# Altium project Kenworth_Overview_2.PrjPcb (part 2 of 4)

## Sheet T-Type_System.SchDoc: <Document>
size Letter; Engineer: <Engineer>; Organization: UPEL; Address1: USU Power Electronics Lab; Address2: USTAR Building 620, RM 118; Address3: 1600 N 620 E; Address4: North Logan, UT 84341; DocumentNumber: 8; Revision: v1; SheetNumber: 8; SheetTotal: 16; ProjectName: <Project>
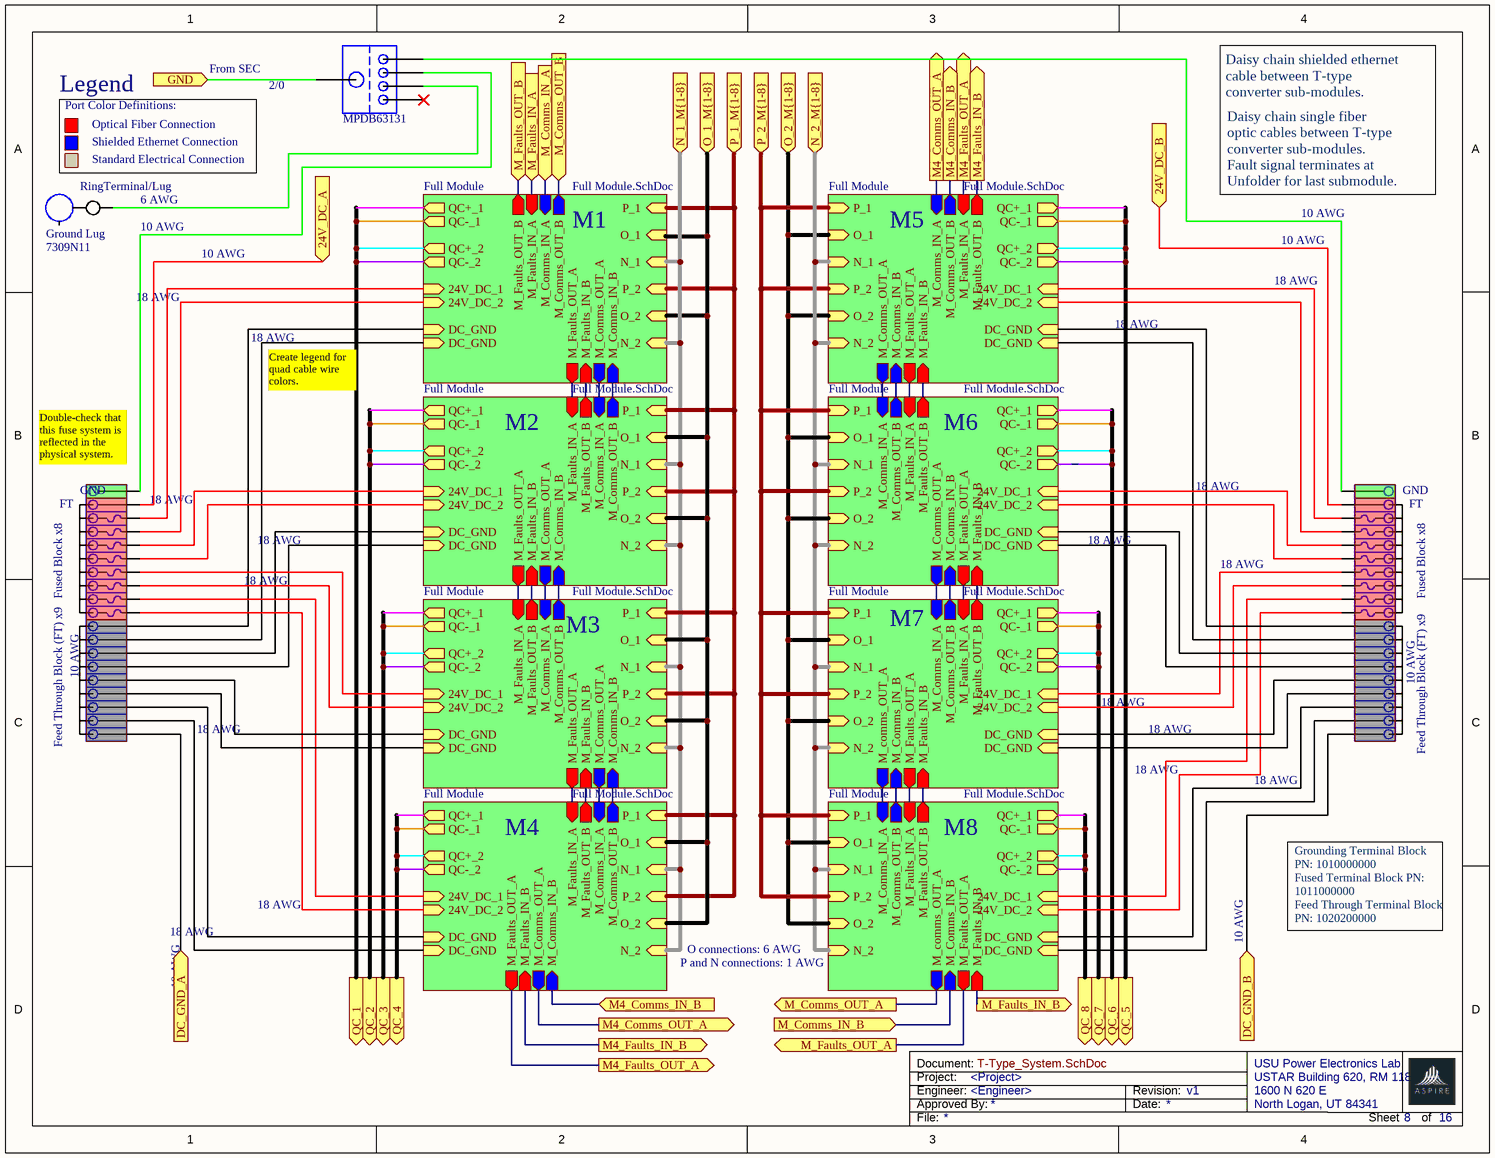
[diagram p5: T-Type_System.SchDoc]

### Parts
(Parts that share a designator on the sheet are numbered #1, #2 ... from top to bottom, then left to right.)
7309N11#1  Ground Lug
*#1  RingTerminal/Lug
J?#1  MPDB63131
J?#2  8_pos_terminal  (value not drawn)
J?#3  8_pos_terminal  (value not drawn)

### Sub-sheets
Full Module = Full Module.SchDoc (file not in this document): M_Faults_IN_B (in), M_Comms_OUT_A (out), M_Faults_IN_A (in), M_Comms_IN_A (in), P_1 (in), O_1 (in), N_1 (in), QC+_1 (out), QC-_1 (out), P_2 (in), O_2 (in), N_2 (in), QC+_2 (out), QC-_2 (out), DC_GND (in), 24V_DC_2 (in), 24V_DC_1 (in), DC_GND (in), M_Comms_OUT_B (out), M_Comms_IN_B (in), M_Faults_OUT_A (out), M_Faults_OUT_B (out)
Full Module = Full Module.SchDoc (file not in this document): M_Faults_IN_B (in), M_Comms_OUT_A (out), M_Faults_OUT_B (out), M_Comms_IN_A (in), P_1 (in), O_1 (in), N_1 (in), QC+_1 (out), QC-_1 (out), P_2 (in), O_2 (in), N_2 (in), QC+_2 (out), QC-_2 (out), DC_GND (in), DC_GND (in), 24V_DC_1 (in), 24V_DC_2 (in), M_Comms_OUT_B (out), M_Comms_IN_B (in), M_Faults_IN_A (in), M_Faults_OUT_A (out)
Full Module = Full Module.SchDoc (file not in this document): M_Faults_IN_B (in), M_comms_OUT_A (out), M_Faults_OUT_B (out), M_Comms_IN_A (in), P_1 (in), O_1 (in), N_1 (in), QC+_1 (out), QC-_1 (out), P_2 (in), O_2 (in), N_2 (in), QC+_2 (out), QC-_2 (out), DC_GND (in), DC_GND (in), 24V_DC_2 (in), 24V_DC_1 (in), M_Comms_OUT_B (out), M_Comms_IN_B (in), M_Faults_OUT_A (out), M_Faults_IN_A (in)
Full Module = Full Module.SchDoc (file not in this document): M_Faults_OUT_A (out), M_comms_OUT_A (out), M_Faults_OUT_B (out), M_Comms_IN_A (in), P_1 (in), O_1 (in), N_1 (in), QC+_1 (out), QC-_1 (out), P_2 (in), O_2 (in), N_2 (in), QC+_2 (out), QC-_2 (out), DC_GND (in), DC_GND (in), 24V_DC_2 (in), 24V_DC_1 (in), M_Comms_OUT_B (out), M_Comms_IN_B (in), M_Faults_IN_A (in), M_Faults_IN_B (in)
Full Module = Full Module.SchDoc (file not in this document): M_Faults_OUT_A (out), M_Comms_OUT_A (out), M_Faults_IN_A (in), M_Comms_IN_A (in), P_1 (in), O_1 (in), N_1 (in), QC+_1 (out), QC-_1 (out), P_2 (in), O_2 (in), N_2 (in), QC+_2 (out), QC-_2 (out), DC_GND (in), 24V_DC_2 (in), 24V_DC_1 (in), DC_GND (in), M_Comms_OUT_B (out), M_Comms_IN_B (in), M_Faults_OUT_B (out), M_Faults_IN_B (in)
Full Module = Full Module.SchDoc (file not in this document): M_Faults_OUT_A (out), M_Comms_OUT_A (out), M_Faults_IN_A (in), M_Comms_IN_A (in), P_1 (in), O_1 (in), N_1 (in), QC+_1 (out), QC-_1 (out), P_2 (in), O_2 (in), N_2 (in), QC+_2 (out), QC-_2 (out), DC_GND (in), DC_GND (in), 24V_DC_1 (in), 24V_DC_2 (in), M_Comms_OUT_B (out), M_Comms_IN_B (in), M_Faults_OUT_B (out), M_Faults_IN_B (in)
Full Module = Full Module.SchDoc (file not in this document): M_Faults_OUT_A (out), M_Comms_OUT_A (out), M_Faults_IN_A (in), M_Comms_IN_A (in), P_1 (in), O_1 (in), N_1 (in), QC+_1 (out), QC-_1 (out), P_2 (in), O_2 (in), N_2 (in), QC+_2 (out), QC-_2 (out), DC_GND (in), DC_GND (in), 24V_DC_2 (in), 24V_DC_1 (in), M_Comms_OUT_B (out), M_Comms_IN_B (in), M_Faults_OUT_B (out), M_Faults_IN_B (in)
Full Module = Full Module.SchDoc (file not in this document): M_Faults_OUT_A (out), M_Comms_OUT_A (out), M_Faults_IN_A (in), M_Comms_IN_A (in), P_1 (in), O_1 (in), N_1 (in), QC+_1 (out), QC-_1 (out), P_2 (in), O_2 (in), N_2 (in), QC+_2 (out), QC-_2 (out), DC_GND (in), DC_GND (in), 24V_DC_2 (in), 24V_DC_1 (in), M_Comms_OUT_B (out), M_Comms_IN_B (in), M_Faults_IN_B (in), M_Faults_OUT_B (out)

### Ports
24V_DC_A (in), 24V_DC_B (in), DC_GND_A (in), DC_GND_B (in), GND (in), M4_Comms_IN_B (in), M4_Comms_IN_B (out), M4_Comms_OUT_A (out), M4_Faults_IN_B (out), M4_Faults_OUT_A (out), M_Comms_IN_A (in), M_Comms_IN_B (in), M_Comms_OUT_A (out), M_Comms_OUT_B (in), M_Faults_IN_A (in), M_Faults_IN_B (out), M_Faults_OUT_A (out), M_Faults_OUT_B (in), N_1_M{1-8} (in), N_2_M{1-8} (in), O_1_M{1-8} (in), O_2_M{1-8} (in), P_1_M{1-8} (in), P_2_M{1-8} (in), QC_1 (out), QC_2 (out), QC_3 (out), QC_4 (out), QC_5 (out), QC_6 (out), QC_7 (out), QC_8 (out)

### Nets
24V_DC_A: J?#2.3 ; port 24V_DC_A
24V_DC_B: J?#3.3 ; port 24V_DC_B
DC_GND_A: J?#2.1 ; port DC_GND_A
DC_GND_B: J?#3.1 ; port DC_GND_B
GND: J?#1.0 ; port GND
M4_Comms_IN_B: port M4_Comms_IN_B, sheet Full Module/M_Comms_OUT_B, sheet Full Module/M_Comms_IN_B
M4_Comms_OUT_A: port M4_Comms_OUT_A, sheet Full Module/M_Comms_IN_A, sheet Full Module/M_Comms_OUT_A
M4_Faults_IN_B: port M4_Faults_IN_B, sheet Full Module/M_Faults_OUT_B, sheet Full Module/M_Faults_IN_B
M4_Faults_OUT_A: port M4_Faults_OUT_A, sheet Full Module/M_Faults_IN_A, sheet Full Module/M_Faults_OUT_A
M_Comms_IN_A: port M_Comms_IN_A, sheet Full Module/M_Comms_IN_A
M_Comms_IN_B: port M_Comms_IN_B, sheet Full Module/M_Comms_IN_B
M_Comms_OUT_A: port M_Comms_OUT_A, sheet Full Module/M_comms_OUT_A
M_Comms_OUT_B: port M_Comms_OUT_B, sheet Full Module/M_Comms_OUT_B
M_Faults_IN_A: port M_Faults_IN_A, sheet Full Module/M_Faults_IN_A
M_Faults_IN_B: port M_Faults_IN_B, sheet Full Module/M_Faults_IN_B
M_Faults_OUT_A: port M_Faults_OUT_A, sheet Full Module/M_Faults_OUT_A
M_Faults_OUT_B: port M_Faults_OUT_B, sheet Full Module/M_Faults_OUT_B
N_1_M{1-8}: port N_1_M{1-8}, sheet Full Module/N_1, sheet Full Module/N_2, sheet Full Module/N_1, sheet Full Module/N_2, sheet Full Module/N_1, sheet Full Module/N_2, sheet Full Module/N_1, sheet Full Module/N_2
N_2_M{1-8}: port N_2_M{1-8}, sheet Full Module/N_1, sheet Full Module/N_2, sheet Full Module/N_1, sheet Full Module/N_2, sheet Full Module/N_1, sheet Full Module/N_2, sheet Full Module/N_1, sheet Full Module/N_2
O_1_M{1-8}: port O_1_M{1-8}, sheet Full Module/O_2, sheet Full Module/O_1, sheet Full Module/O_2, sheet Full Module/O_1, sheet Full Module/O_2, sheet Full Module/O_1, sheet Full Module/O_2
O_2_M{1-8}: port O_2_M{1-8}, sheet Full Module/O_1, sheet Full Module/O_2, sheet Full Module/O_1, sheet Full Module/O_2, sheet Full Module/O_1, sheet Full Module/O_2, sheet Full Module/O_1, sheet Full Module/O_2
P_1_M{1-8}: port P_1_M{1-8}, sheet Full Module/P_1, sheet Full Module/P_2, sheet Full Module/P_1, sheet Full Module/P_2, sheet Full Module/P_1, sheet Full Module/P_2, sheet Full Module/P_1, sheet Full Module/P_2
P_2_M{1-8}: port P_2_M{1-8}, sheet Full Module/P_1, sheet Full Module/P_2, sheet Full Module/P_1, sheet Full Module/P_2, sheet Full Module/P_1, sheet Full Module/P_2, sheet Full Module/P_1, sheet Full Module/P_2
QC_1: port QC_1, sheet Full Module/QC+_1, sheet Full Module/QC-_1, sheet Full Module/QC+_2, sheet Full Module/QC-_2
QC_2: port QC_2, sheet Full Module/QC+_1, sheet Full Module/QC-_1, sheet Full Module/QC+_2, sheet Full Module/QC-_2
QC_3: port QC_3, sheet Full Module/QC+_1, sheet Full Module/QC-_1, sheet Full Module/QC+_2, sheet Full Module/QC-_2
QC_4: port QC_4, sheet Full Module/QC+_1, sheet Full Module/QC-_1, sheet Full Module/QC+_2, sheet Full Module/QC-_2
QC_5: port QC_5, sheet Full Module/QC+_1, sheet Full Module/QC-_1, sheet Full Module/QC+_2, sheet Full Module/QC-_2
QC_6: port QC_6, sheet Full Module/QC+_1, sheet Full Module/QC-_1, sheet Full Module/QC+_2, sheet Full Module/QC-_2
QC_7: port QC_7, sheet Full Module/QC+_1, sheet Full Module/QC-_1, sheet Full Module/QC+_2, sheet Full Module/QC-_2
QC_8: port QC_8, sheet Full Module/QC+_1, sheet Full Module/QC-_1, sheet Full Module/QC+_2, sheet Full Module/QC-_2
Net7309N11#1_5: 7309N11#1.5 *#1.2_13
Net*#1_2_12: *#1.2_12 J?#1.2
NetJ?#1_4: J?#1.4 J?#2.1
NetJ?#1_5: J?#1.5 J?#3.1
NetJ?#2_1: J?#2.1 ; sheet Full Module/DC_GND
NetJ?#2_1: J?#2.1 ; sheet Full Module/DC_GND  [a separate net that carries the same name]
NetJ?#2_1: J?#2.1 ; sheet Full Module/DC_GND  [a separate net that carries the same name]
NetJ?#2_1: J?#2.1 ; sheet Full Module/DC_GND  [a separate net that carries the same name]
NetJ?#2_1: J?#2.1 ; sheet Full Module/DC_GND  [a separate net that carries the same name]
NetJ?#2_1: J?#2.1 ; sheet Full Module/DC_GND  [a separate net that carries the same name]
NetJ?#2_1: J?#2.1 ; sheet Full Module/DC_GND  [a separate net that carries the same name]
NetJ?#2_1: J?#2.1 ; sheet Full Module/DC_GND  [a separate net that carries the same name]
NetJ?#2_3: J?#2.3 ; sheet Full Module/24V_DC_1
NetJ?#2_3: J?#2.3 ; sheet Full Module/24V_DC_2  [a separate net that carries the same name]
NetJ?#2_3: J?#2.3 ; sheet Full Module/24V_DC_2  [a separate net that carries the same name]
NetJ?#2_3: J?#2.3 ; sheet Full Module/24V_DC_1  [a separate net that carries the same name]
NetJ?#2_3: J?#2.3 ; sheet Full Module/24V_DC_2  [a separate net that carries the same name]
NetJ?#2_3: J?#2.3 ; sheet Full Module/24V_DC_1  [a separate net that carries the same name]
NetJ?#2_3: J?#2.3 ; sheet Full Module/24V_DC_2  [a separate net that carries the same name]
NetJ?#2_3: J?#2.3 ; sheet Full Module/24V_DC_1  [a separate net that carries the same name]
NetJ?#3_1: J?#3.1 ; sheet Full Module/DC_GND
NetJ?#3_1: J?#3.1 ; sheet Full Module/DC_GND  [a separate net that carries the same name]
NetJ?#3_1: J?#3.1 ; sheet Full Module/DC_GND  [a separate net that carries the same name]
NetJ?#3_1: J?#3.1 ; sheet Full Module/DC_GND  [a separate net that carries the same name]
NetJ?#3_1: J?#3.1 ; sheet Full Module/DC_GND  [a separate net that carries the same name]
NetJ?#3_1: J?#3.1 ; sheet Full Module/DC_GND  [a separate net that carries the same name]
NetJ?#3_1: J?#3.1 ; sheet Full Module/DC_GND  [a separate net that carries the same name]
NetJ?#3_1: J?#3.1 ; sheet Full Module/DC_GND  [a separate net that carries the same name]
NetJ?#3_3: J?#3.3 ; sheet Full Module/24V_DC_1
NetJ?#3_3: J?#3.3 ; sheet Full Module/24V_DC_2  [a separate net that carries the same name]
NetJ?#3_3: J?#3.3 ; sheet Full Module/24V_DC_2  [a separate net that carries the same name]
NetJ?#3_3: J?#3.3 ; sheet Full Module/24V_DC_1  [a separate net that carries the same name]
NetJ?#3_3: J?#3.3 ; sheet Full Module/24V_DC_2  [a separate net that carries the same name]
NetJ?#3_3: J?#3.3 ; sheet Full Module/24V_DC_1  [a separate net that carries the same name]
NetJ?#3_3: J?#3.3 ; sheet Full Module/24V_DC_2  [a separate net that carries the same name]
NetJ?#3_3: J?#3.3 ; sheet Full Module/24V_DC_1  [a separate net that carries the same name]
(unnamed): sheet Full Module/M_Faults_IN_B, sheet Full Module/M_Faults_OUT_B
(unnamed): sheet Full Module/M_Comms_OUT_A, sheet Full Module/M_Comms_IN_A
(unnamed): sheet Full Module/M_Comms_IN_B, sheet Full Module/M_Comms_OUT_B
(unnamed): sheet Full Module/M_Faults_OUT_A, sheet Full Module/M_Faults_IN_A
(unnamed): sheet Full Module/M_Faults_IN_B, sheet Full Module/M_Faults_OUT_B
(unnamed): sheet Full Module/M_Comms_OUT_A, sheet Full Module/M_Comms_IN_A
(unnamed): sheet Full Module/M_Comms_IN_B, sheet Full Module/M_Comms_OUT_B
(unnamed): sheet Full Module/M_Faults_OUT_A, sheet Full Module/M_Faults_IN_A
(unnamed): sheet Full Module/M_Faults_IN_B, sheet Full Module/M_Faults_OUT_B
(unnamed): sheet Full Module/M_comms_OUT_A, sheet Full Module/M_Comms_IN_A
(unnamed): sheet Full Module/M_Comms_IN_B, sheet Full Module/M_Comms_OUT_B
(unnamed): sheet Full Module/M_Faults_OUT_A, sheet Full Module/M_Faults_IN_A
(unnamed): sheet Full Module/M_Faults_OUT_A, sheet Full Module/M_Faults_IN_A
(unnamed): sheet Full Module/M_Comms_OUT_A, sheet Full Module/M_Comms_IN_A
(unnamed): sheet Full Module/M_Comms_IN_B, sheet Full Module/M_Comms_OUT_B
(unnamed): sheet Full Module/M_Faults_IN_B, sheet Full Module/M_Faults_OUT_B
(unnamed): sheet Full Module/M_Faults_OUT_A, sheet Full Module/M_Faults_IN_A
(unnamed): sheet Full Module/M_Comms_OUT_A, sheet Full Module/M_Comms_IN_A
(unnamed): sheet Full Module/M_Comms_IN_B, sheet Full Module/M_Comms_OUT_B
(unnamed): sheet Full Module/M_Faults_IN_B, sheet Full Module/M_Faults_OUT_B
(unnamed): sheet Full Module/M_Faults_OUT_A, sheet Full Module/M_Faults_IN_A
(unnamed): sheet Full Module/M_Comms_OUT_A, sheet Full Module/M_Comms_IN_A
(unnamed): sheet Full Module/M_Comms_IN_B, sheet Full Module/M_Comms_OUT_B
(unnamed): sheet Full Module/M_Faults_IN_B, sheet Full Module/M_Faults_OUT_B

Not connected (* = marked no-connect by the designer): J?#1 1*

### Notes on the sheet
- Legend
- From SEC
- 2/0
- Port Color Definitions:
- Optical Fiber Connection
- Shielded Ethernet Connection
- Standard Electrical Connection
- Daisy chain shielded ethernet
  cable between T-type
  converter sub-modules.
- 10 AWG
- 6 AWG
- M1
- M5
- Daisy chain single fiber
  optic cables between T-type
  converter sub-modules.
  Fault signal terminates at
  Unfolder for last submodule.
- 18 AWG
- Create legend for quad cable wire colors.
- M2
- M6
- (near J?#2) Double-check that this fuse system is reflected in the physical system.
- (near J?#2) FT
- (near J?#2) GND
- (near J?#3) GND
- (near J?#3) FT
- (near J?#2) Fused Block x8
- (near J?#2) 10 AWG
- M3
- M7
- (near J?#3) 10 AWG
- (near J?#3) Fused Block x8
- (near J?#2) Feed Through Block (FT) x9
- (near J?#3) Feed Through Block (FT) x9
- M4
- M8
- Grounding Terminal Block PN: 1010000000
- Fused Terminal Block PN: 1011000000
- P and N connections: 1 AWG
- O connections: 6 AWG
- Feed Through Terminal Block PN: 1020200000
- Project:
- Engineer:
- Document:
- Approved By:
- Date:
- Revision:
- File:
- Sheet
- of

### Library data of the parts
7309N11#1 = 7309N11
J?#1 = 4_to_1
J?#2 J?#3 = Full_Terminal_Block

## Sheet Coolant_System.SchDoc: <Document>
size Letter; Engineer: <Engineer>; Organization: UPEL; Address1: USU Power Electronics Lab; Address2: USTAR Building 620, RM 118; Address3: 1600 N 620 E; Address4: North Logan, UT 84341; DocumentNumber: 15; Revision: v1; SheetNumber: 15; SheetTotal: 16; ProjectName: <Project>
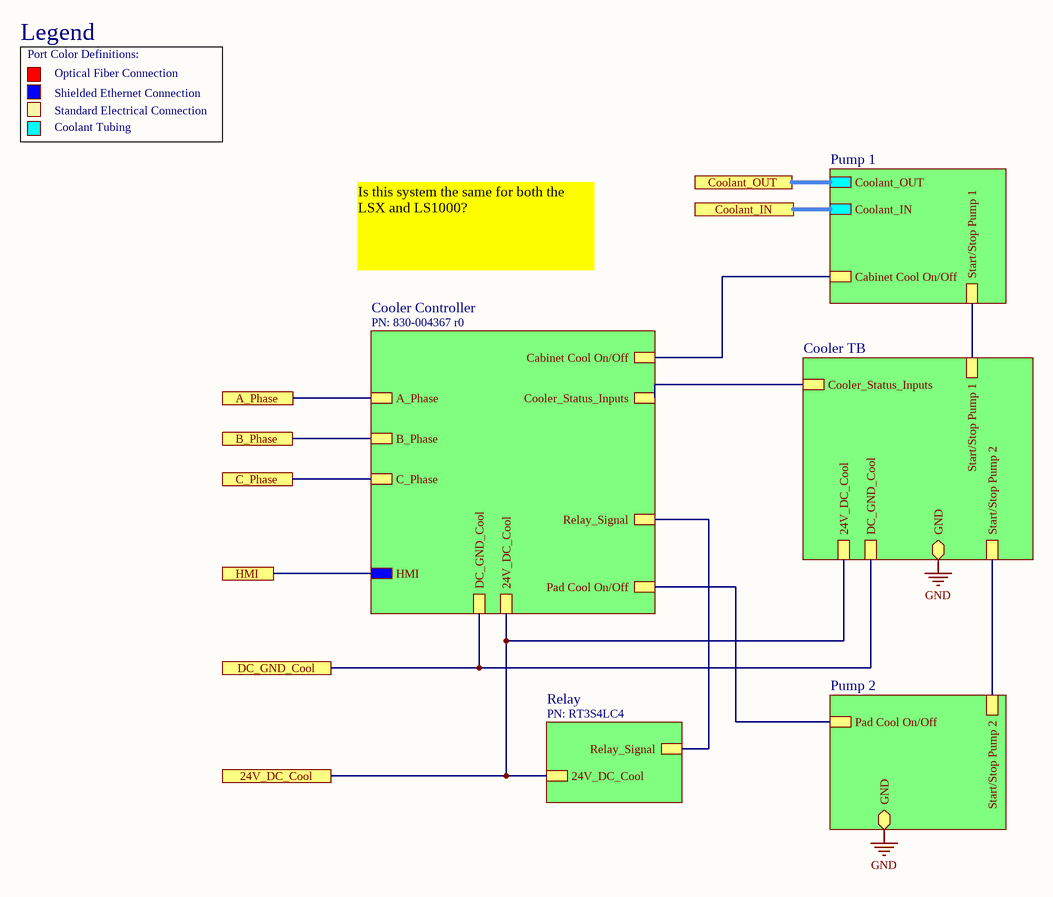
[diagram p6: Coolant_System.SchDoc]

### Sub-sheets
Designator = Cooler Controller (file not in this document): DC_GND_Cool, 24V_DC_Cool, HMI, A_Phase, B_Phase, C_Phase, Relay_Signal, Cooler_Status_Inputs, Pad Cool On/Off, Cabinet Cool On/Off
Designator = Pump 1 (file not in this document): Cabinet Cool On/Off, Coolant_OUT, Coolant_IN, Start/Stop Pump 1
Designator = Pump 2 (file not in this document): Pad Cool On/Off, Start/Stop Pump 2, GND (bidir)
Designator = Cooler TB (file not in this document): Cooler_Status_Inputs, 24V_DC_Cool, DC_GND_Cool, GND (bidir), Start/Stop Pump 1, Start/Stop Pump 2
Relay = Relay (file not in this document): 24V_DC_Cool, Relay_Signal

### Ports
24V_DC_Cool, A_Phase, B_Phase, C_Phase, Coolant_IN, Coolant_OUT, DC_GND_Cool, HMI

### Nets
GND: sheet Designator/GND, sheet Designator/GND
24V_DC_Cool: port 24V_DC_Cool, sheet Relay/24V_DC_Cool, sheet Designator/24V_DC_Cool, sheet Designator/24V_DC_Cool
A_Phase: port A_Phase, sheet Designator/A_Phase
B_Phase: port B_Phase, sheet Designator/B_Phase
C_Phase: port C_Phase, sheet Designator/C_Phase
Coolant_IN: port Coolant_IN, sheet Designator/Coolant_IN
Coolant_OUT: port Coolant_OUT, sheet Designator/Coolant_OUT
DC_GND_Cool: port DC_GND_Cool, sheet Designator/DC_GND_Cool, sheet Designator/DC_GND_Cool
HMI: port HMI, sheet Designator/HMI
(unnamed): sheet Relay/Relay_Signal, sheet Designator/Relay_Signal
(unnamed): sheet Designator/Cooler_Status_Inputs, sheet Designator/Cooler_Status_Inputs
(unnamed): sheet Designator/Pad Cool On/Off, sheet Designator/Pad Cool On/Off
(unnamed): sheet Designator/Cabinet Cool On/Off, sheet Designator/Cabinet Cool On/Off
(unnamed): sheet Designator/Start/Stop Pump 1, sheet Designator/Start/Stop Pump 1
(unnamed): sheet Designator/Start/Stop Pump 2, sheet Designator/Start/Stop Pump 2

### Notes on the sheet
- Legend
- Port Color Definitions:
- Optical Fiber Connection
- Shielded Ethernet Connection
- Standard Electrical Connection
- Coolant Tubing
- Is this system the same for both the LSX and LS1000?
- PN: 830-004367 r0
- PN: RT3S4LC4
- Project:
- Engineer:
- Document:
- Approved By:
- Date:
- Revision:
- File:
- Sheet
- of

## Sheet Current_and_Water_Sensing_System.SchDoc
size A
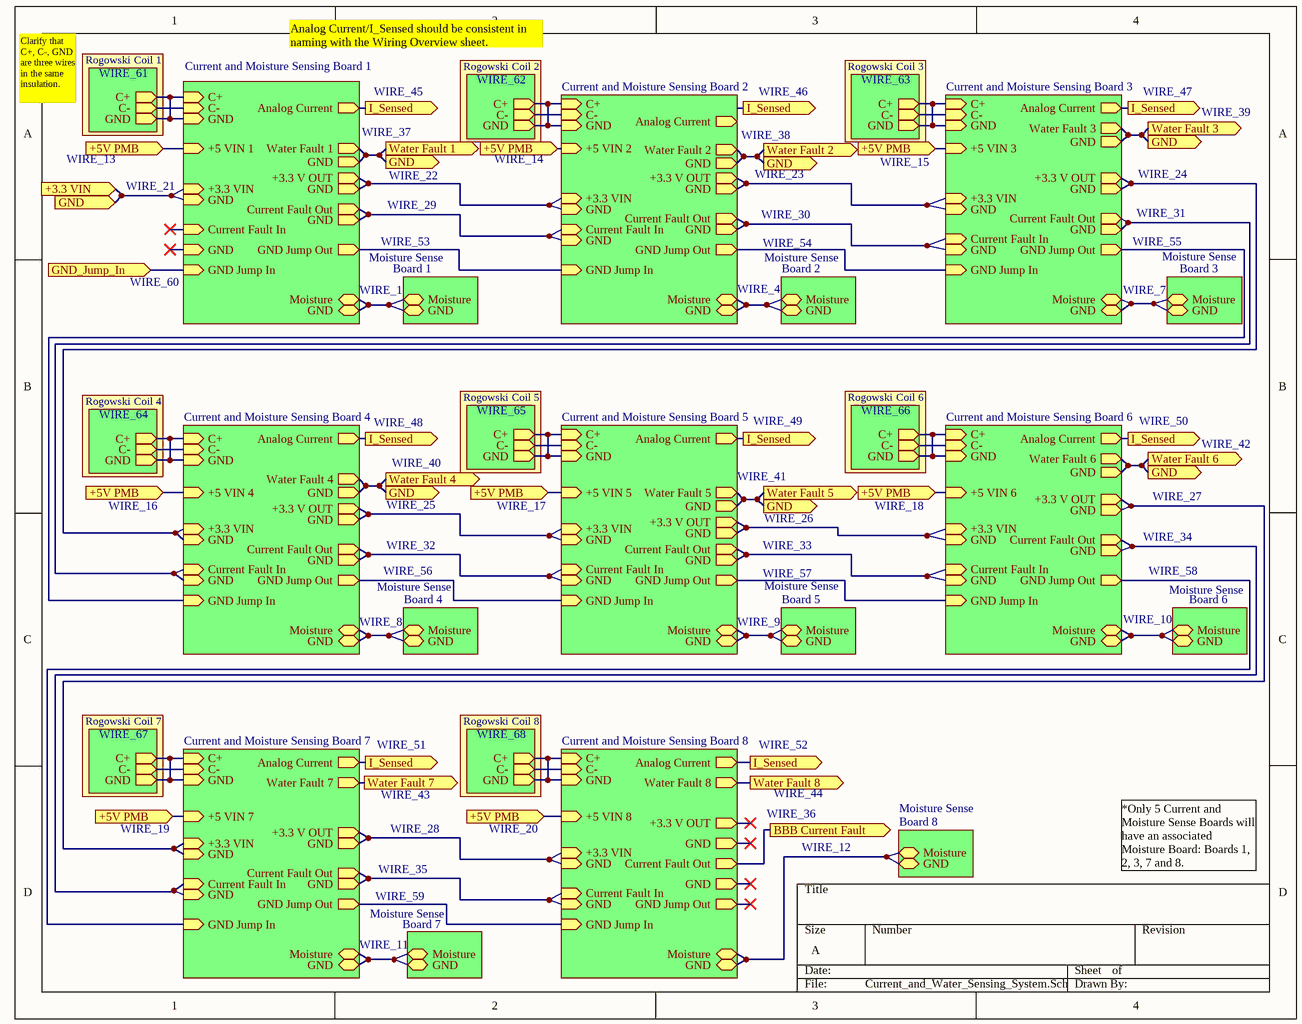
[diagram p7: Current_and_Water_Sensing_System.SchDoc]

### Sub-sheets
Board 1 = File Name (file not in this document): GND (bidir), Moisture (bidir)
Board 2 = File Name (file not in this document): GND (bidir), Moisture (bidir)
Board 3 = File Name (file not in this document): GND (bidir), Moisture (bidir)
Board 4 = File Name (file not in this document): GND (bidir), Moisture (bidir)
Board 5 = File Name (file not in this document): GND (bidir), Moisture (bidir)
Board 6 = File Name (file not in this document): GND (bidir), Moisture (bidir)
Board 7 = File Name (file not in this document): GND (bidir), Moisture (bidir)
Board 8 = File Name (file not in this document): GND (bidir), Moisture (bidir)
Coil 1 = File Name (file not in this document): GND (out), C- (out), C+ (out)
Coil 2 = File Name (file not in this document): GND (out), C- (out), C+ (out)
Coil 3 = File Name (file not in this document): GND (out), C- (out), C+ (out)
Coil 4 = File Name (file not in this document): GND (out), C- (out), C+ (out)
Coil 5 = File Name (file not in this document): GND (out), C- (out), C+ (out)
Coil 6 = File Name (file not in this document): GND (out), C- (out), C+ (out)
Coil 7 = File Name (file not in this document): GND (out), C- (out), C+ (out)
Coil 8 = File Name (file not in this document): GND (out), C- (out), C+ (out)
Current and Moisture Sensing Board 1 = File Name (file not in this document): C- (in), GND (in), Analog Current (out), Water Fault 1 (out), GND (bidir), +3.3 V OUT (out), GND Jump Out (out), +5 VIN 1 (in), +3.3 VIN (in), Current Fault Out (out), Moisture (bidir), Current Fault In (in), GND (in), GND (in), GND (out), GND (out), GND Jump In (in), GND (out), C+ (in)
Current and Moisture Sensing Board 2 = File Name (file not in this document): Analog Current (out), Water Fault 2 (out), GND (bidir), +3.3 V OUT (out), GND Jump Out (out), +5 VIN 2 (in), +3.3 VIN (in), Current Fault Out (out), Moisture (bidir), Current Fault In (in), GND (in), GND (in), GND (out), GND (out), GND Jump In (in), GND (out), C- (in), GND (in), C+ (in)
Current and Moisture Sensing Board 3 = File Name (file not in this document): Analog Current (out), Water Fault 3 (out), GND (bidir), +3.3 V OUT (out), GND Jump Out (out), +5 VIN 3 (in), +3.3 VIN (in), Current Fault Out (out), Moisture (bidir), Current Fault In (in), GND (in), GND (in), GND (out), GND (out), GND Jump In (in), GND (out), C- (in), GND (in), C+ (in)
Current and Moisture Sensing Board 4 = File Name (file not in this document): Analog Current (out), Water Fault 4 (out), GND (bidir), +3.3 V OUT (out), GND Jump Out (out), +5 VIN 4 (in), +3.3 VIN (in), Current Fault Out (out), Moisture (bidir), Current Fault In (in), GND (in), GND (in), GND (out), GND (out), GND Jump In (in), GND (out), C- (in), GND (in), C+ (in)
Current and Moisture Sensing Board 5 = File Name (file not in this document): Analog Current (out), Water Fault 5 (out), GND (bidir), +3.3 V OUT (out), GND Jump Out (out), +5 VIN 5 (in), +3.3 VIN (in), Current Fault Out (out), Moisture (bidir), Current Fault In (in), GND (in), GND (in), GND (out), GND (out), GND Jump In (in), GND (out), C- (in), GND (in), C+ (in)
Current and Moisture Sensing Board 6 = File Name (file not in this document): Analog Current (out), Water Fault 6 (out), GND (bidir), +3.3 V OUT (out), GND Jump Out (out), +5 VIN 6 (in), +3.3 VIN (in), Current Fault Out (out), Moisture (bidir), Current Fault In (in), GND (in), GND (in), GND (out), GND (out), GND Jump In (in), GND (out), C- (in), GND (in), C+ (in)
Current and Moisture Sensing Board 7 = File Name (file not in this document): Analog Current (out), Water Fault 7 (out), +3.3 V OUT (out), GND Jump Out (out), +5 VIN 7 (in), +3.3 VIN (in), Current Fault Out (out), Current Fault In (in), GND (in), GND (in), GND (out), GND (out), GND Jump In (in), Moisture (bidir), GND (bidir), C- (in), GND (in), C+ (in)
Current and Moisture Sensing Board 8 = File Name (file not in this document): Analog Current (out), Water Fault 8 (out), +3.3 V OUT (out), GND Jump Out (out), +5 VIN 8 (in), +3.3 VIN (in), Current Fault Out (out), Current Fault In (in), GND (in), GND (in), GND (out), GND (out), GND Jump In (in), Moisture (bidir), GND (bidir), C- (in), GND (in), C+ (in)

### Ports
+3.3 VIN (in), +5V PMB (in), BBB Current Fault (out), GND (in), GND (out), GND_Jump_In (in), I_Sensed (out), Water Fault 1 (out), Water Fault 2 (out), Water Fault 3 (out), Water Fault 4 (out), Water Fault 5 (out), Water Fault 6 (out), Water Fault 7 (out), Water Fault 8 (out)

### Nets
+3.3 VIN: port Water Fault 1, port Water Fault 4, port Water Fault 2, port Water Fault 5, port Water Fault 3, port Water Fault 6, port +3.3 VIN, port GND, sheet Current and Moisture Sensing Board 2/Water Fault 2, sheet Current and Moisture Sensing Board 2/GND, sheet Current and Moisture Sensing Board 1/Water Fault 1, sheet Current and Moisture Sensing Board 1/+3.3 VIN, sheet Current and Moisture Sensing Board 1/GND, sheet Current and Moisture Sensing Board 1/GND, sheet Current and Moisture Sensing Board 4/Water Fault 4, sheet Current and Moisture Sensing Board 4/GND, sheet Current and Moisture Sensing Board 5/Water Fault 5, sheet Current and Moisture Sensing Board 5/GND, sheet Current and Moisture Sensing Board 6/Water Fault 6, sheet Current and Moisture Sensing Board 6/GND, sheet Current and Moisture Sensing Board 3/Water Fault 3, sheet Current and Moisture Sensing Board 3/GND
+5V PMB: port +5V PMB, sheet Current and Moisture Sensing Board 2/+5 VIN 2, sheet Current and Moisture Sensing Board 1/+5 VIN 1, sheet Current and Moisture Sensing Board 4/+5 VIN 4, sheet Current and Moisture Sensing Board 7/+5 VIN 7, sheet Current and Moisture Sensing Board 5/+5 VIN 5, sheet Current and Moisture Sensing Board 6/+5 VIN 6, sheet Current and Moisture Sensing Board 3/+5 VIN 3, sheet Current and Moisture Sensing Board 8/+5 VIN 8
BBB Current Fault: port BBB Current Fault, sheet Current and Moisture Sensing Board 8/Current Fault Out
GND_Jump_In: port GND_Jump_In, sheet Current and Moisture Sensing Board 1/GND Jump In
I_Sensed: port I_Sensed, sheet Current and Moisture Sensing Board 1/Analog Current, sheet Current and Moisture Sensing Board 4/Analog Current, sheet Current and Moisture Sensing Board 7/Analog Current, sheet Current and Moisture Sensing Board 5/Analog Current, sheet Current and Moisture Sensing Board 6/Analog Current, sheet Current and Moisture Sensing Board 3/Analog Current, sheet Current and Moisture Sensing Board 8/Analog Current
Water Fault 7: port Water Fault 7, sheet Current and Moisture Sensing Board 7/Water Fault 7
Water Fault 8: port Water Fault 8, sheet Current and Moisture Sensing Board 8/Water Fault 8
(unnamed): sheet Current and Moisture Sensing Board 2/GND, sheet Current and Moisture Sensing Board 2/Moisture, sheet Board 2/GND, sheet Board 2/Moisture
(unnamed): sheet Current and Moisture Sensing Board 2/+3.3 V OUT, sheet Current and Moisture Sensing Board 2/GND, sheet Current and Moisture Sensing Board 3/+3.3 VIN, sheet Current and Moisture Sensing Board 3/GND
(unnamed): sheet Current and Moisture Sensing Board 2/GND Jump Out, sheet Current and Moisture Sensing Board 3/GND Jump In
(unnamed): sheet Current and Moisture Sensing Board 2/+3.3 VIN, sheet Current and Moisture Sensing Board 2/GND, sheet Current and Moisture Sensing Board 1/+3.3 V OUT, sheet Current and Moisture Sensing Board 1/GND
(unnamed): sheet Current and Moisture Sensing Board 2/Current Fault Out, sheet Current and Moisture Sensing Board 2/GND, sheet Current and Moisture Sensing Board 3/Current Fault In, sheet Current and Moisture Sensing Board 3/GND
(unnamed): sheet Current and Moisture Sensing Board 2/Current Fault In, sheet Current and Moisture Sensing Board 2/GND, sheet Current and Moisture Sensing Board 1/Current Fault Out, sheet Current and Moisture Sensing Board 1/GND
(unnamed): sheet Current and Moisture Sensing Board 2/GND Jump In, sheet Current and Moisture Sensing Board 1/GND Jump Out
(unnamed): sheet Current and Moisture Sensing Board 2/C-, sheet Coil 2/C-
(unnamed): sheet Current and Moisture Sensing Board 2/GND, sheet Current and Moisture Sensing Board 2/C+, sheet Coil 2/GND, sheet Coil 2/C+
(unnamed): sheet Board 1/GND, sheet Board 1/Moisture, sheet Current and Moisture Sensing Board 1/GND, sheet Current and Moisture Sensing Board 1/Moisture
(unnamed): sheet Current and Moisture Sensing Board 1/C-, sheet Coil 1/C-
(unnamed): sheet Current and Moisture Sensing Board 1/GND, sheet Current and Moisture Sensing Board 1/C+, sheet Coil 1/GND, sheet Coil 1/C+
(unnamed): sheet Current and Moisture Sensing Board 4/GND, sheet Current and Moisture Sensing Board 4/Moisture, sheet Board 4/GND, sheet Board 4/Moisture
(unnamed): sheet Current and Moisture Sensing Board 4/+3.3 V OUT, sheet Current and Moisture Sensing Board 4/GND, sheet Current and Moisture Sensing Board 5/+3.3 VIN, sheet Current and Moisture Sensing Board 5/GND
(unnamed): sheet Current and Moisture Sensing Board 4/GND Jump Out, sheet Current and Moisture Sensing Board 5/GND Jump In
(unnamed): sheet Current and Moisture Sensing Board 4/+3.3 VIN, sheet Current and Moisture Sensing Board 4/GND, sheet Current and Moisture Sensing Board 3/+3.3 V OUT, sheet Current and Moisture Sensing Board 3/GND
(unnamed): sheet Current and Moisture Sensing Board 4/Current Fault Out, sheet Current and Moisture Sensing Board 4/GND, sheet Current and Moisture Sensing Board 5/Current Fault In, sheet Current and Moisture Sensing Board 5/GND
(unnamed): sheet Current and Moisture Sensing Board 4/Current Fault In, sheet Current and Moisture Sensing Board 4/GND, sheet Current and Moisture Sensing Board 3/Current Fault Out, sheet Current and Moisture Sensing Board 3/GND
(unnamed): sheet Current and Moisture Sensing Board 4/GND Jump In, sheet Current and Moisture Sensing Board 3/GND Jump Out
(unnamed): sheet Current and Moisture Sensing Board 4/C-, sheet Coil 4/C-
(unnamed): sheet Current and Moisture Sensing Board 4/GND, sheet Current and Moisture Sensing Board 4/C+, sheet Coil 4/GND, sheet Coil 4/C+
(unnamed): sheet Current and Moisture Sensing Board 7/+3.3 V OUT, sheet Current and Moisture Sensing Board 7/GND, sheet Current and Moisture Sensing Board 8/+3.3 VIN, sheet Current and Moisture Sensing Board 8/GND
(unnamed): sheet Current and Moisture Sensing Board 7/GND Jump Out, sheet Current and Moisture Sensing Board 8/GND Jump In
(unnamed): sheet Current and Moisture Sensing Board 7/+3.3 VIN, sheet Current and Moisture Sensing Board 7/GND, sheet Current and Moisture Sensing Board 6/+3.3 V OUT, sheet Current and Moisture Sensing Board 6/GND
(unnamed): sheet Current and Moisture Sensing Board 7/Current Fault Out, sheet Current and Moisture Sensing Board 7/GND, sheet Current and Moisture Sensing Board 8/Current Fault In, sheet Current and Moisture Sensing Board 8/GND
(unnamed): sheet Current and Moisture Sensing Board 7/Current Fault In, sheet Current and Moisture Sensing Board 7/GND, sheet Current and Moisture Sensing Board 6/Current Fault Out, sheet Current and Moisture Sensing Board 6/GND
(unnamed): sheet Current and Moisture Sensing Board 7/GND Jump In, sheet Current and Moisture Sensing Board 6/GND Jump Out
(unnamed): sheet Current and Moisture Sensing Board 7/Moisture, sheet Current and Moisture Sensing Board 7/GND, sheet Board 7/GND, sheet Board 7/Moisture
(unnamed): sheet Current and Moisture Sensing Board 7/C-, sheet Coil 7/C-
(unnamed): sheet Current and Moisture Sensing Board 7/GND, sheet Current and Moisture Sensing Board 7/C+, sheet Coil 7/GND, sheet Coil 7/C+
(unnamed): sheet Current and Moisture Sensing Board 5/GND, sheet Current and Moisture Sensing Board 5/Moisture, sheet Board 5/GND, sheet Board 5/Moisture
(unnamed): sheet Current and Moisture Sensing Board 5/+3.3 V OUT, sheet Current and Moisture Sensing Board 5/GND, sheet Current and Moisture Sensing Board 6/+3.3 VIN, sheet Current and Moisture Sensing Board 6/GND
(unnamed): sheet Current and Moisture Sensing Board 5/GND Jump Out, sheet Current and Moisture Sensing Board 6/GND Jump In
(unnamed): sheet Current and Moisture Sensing Board 5/Current Fault Out, sheet Current and Moisture Sensing Board 5/GND, sheet Current and Moisture Sensing Board 6/Current Fault In, sheet Current and Moisture Sensing Board 6/GND
(unnamed): sheet Current and Moisture Sensing Board 5/C-, sheet Coil 5/C-
(unnamed): sheet Current and Moisture Sensing Board 5/GND, sheet Current and Moisture Sensing Board 5/C+, sheet Coil 5/GND, sheet Coil 5/C+
(unnamed): sheet Current and Moisture Sensing Board 6/GND, sheet Current and Moisture Sensing Board 6/Moisture, sheet Board 6/GND, sheet Board 6/Moisture
(unnamed): sheet Current and Moisture Sensing Board 6/C-, sheet Coil 6/C-
(unnamed): sheet Current and Moisture Sensing Board 6/GND, sheet Current and Moisture Sensing Board 6/C+, sheet Coil 6/GND, sheet Coil 6/C+
(unnamed): sheet Current and Moisture Sensing Board 3/GND, sheet Current and Moisture Sensing Board 3/Moisture, sheet Board 3/GND, sheet Board 3/Moisture
(unnamed): sheet Current and Moisture Sensing Board 3/C-, sheet Coil 3/C-
(unnamed): sheet Current and Moisture Sensing Board 3/GND, sheet Current and Moisture Sensing Board 3/C+, sheet Coil 3/GND, sheet Coil 3/C+
(unnamed): sheet Current and Moisture Sensing Board 8/Moisture, sheet Current and Moisture Sensing Board 8/GND, sheet Board 8/GND, sheet Board 8/Moisture
(unnamed): sheet Current and Moisture Sensing Board 8/C-, sheet Coil 8/C-
(unnamed): sheet Current and Moisture Sensing Board 8/GND, sheet Current and Moisture Sensing Board 8/C+, sheet Coil 8/GND, sheet Coil 8/C+

### Notes on the sheet
- Clarify that C+, C-, GND are three wires in the same insulation.
- Rogowski
- WIRE_61
- Analog Current/I_Sensed should be consistent in naming with the Wiring Overview sheet.
- WIRE_45
- WIRE_62
- WIRE_46
- WIRE_63
- WIRE_47
- WIRE_13
- WIRE_37
- WIRE_14
- WIRE_38
- WIRE_15
- WIRE_39
- WIRE_21
- WIRE_29
- WIRE_22
- WIRE_23
- WIRE_30
- WIRE_31
- WIRE_24
- WIRE_60
- WIRE_1
- Moisture Sense
- WIRE_53
- WIRE_4
- WIRE_54
- WIRE_7
- WIRE_55
- WIRE_64
- WIRE_48
- WIRE_65
- WIRE_49
- WIRE_66
- WIRE_50
- WIRE_25
- WIRE_40
- WIRE_41
- WIRE_27
- WIRE_42
- WIRE_16
- WIRE_56
- WIRE_32
- WIRE_17
- WIRE_33
- WIRE_26
- WIRE_18
- WIRE_34
- WIRE_58
- WIRE_8
- WIRE_9
- WIRE_57
- WIRE_10
- WIRE_67
- WIRE_51
- WIRE_68
- WIRE_52
- WIRE_19
- WIRE_43
- WIRE_28
- WIRE_20
- WIRE_36
- WIRE_44
- WIRE_59
- WIRE_35
- WIRE_12
- *Only 5 Current and Moisture Sense Boards will have an associated Moisture Board: Boards 1, 2, 3, 7 and 8.
- WIRE_11

## Sheet Top_Overview.SchDoc: <Document>
size Letter; Engineer: <Engineer>; Organization: UPEL; Address1: USU Power Electronics Lab; Address2: USTAR Building 620, RM 118; Address3: 1600 N 620 E; Address4: North Logan, UT 84341; DocumentNumber: 1; Revision: v1; SheetNumber: 1; SheetTotal: 16; ProjectName: <Project>
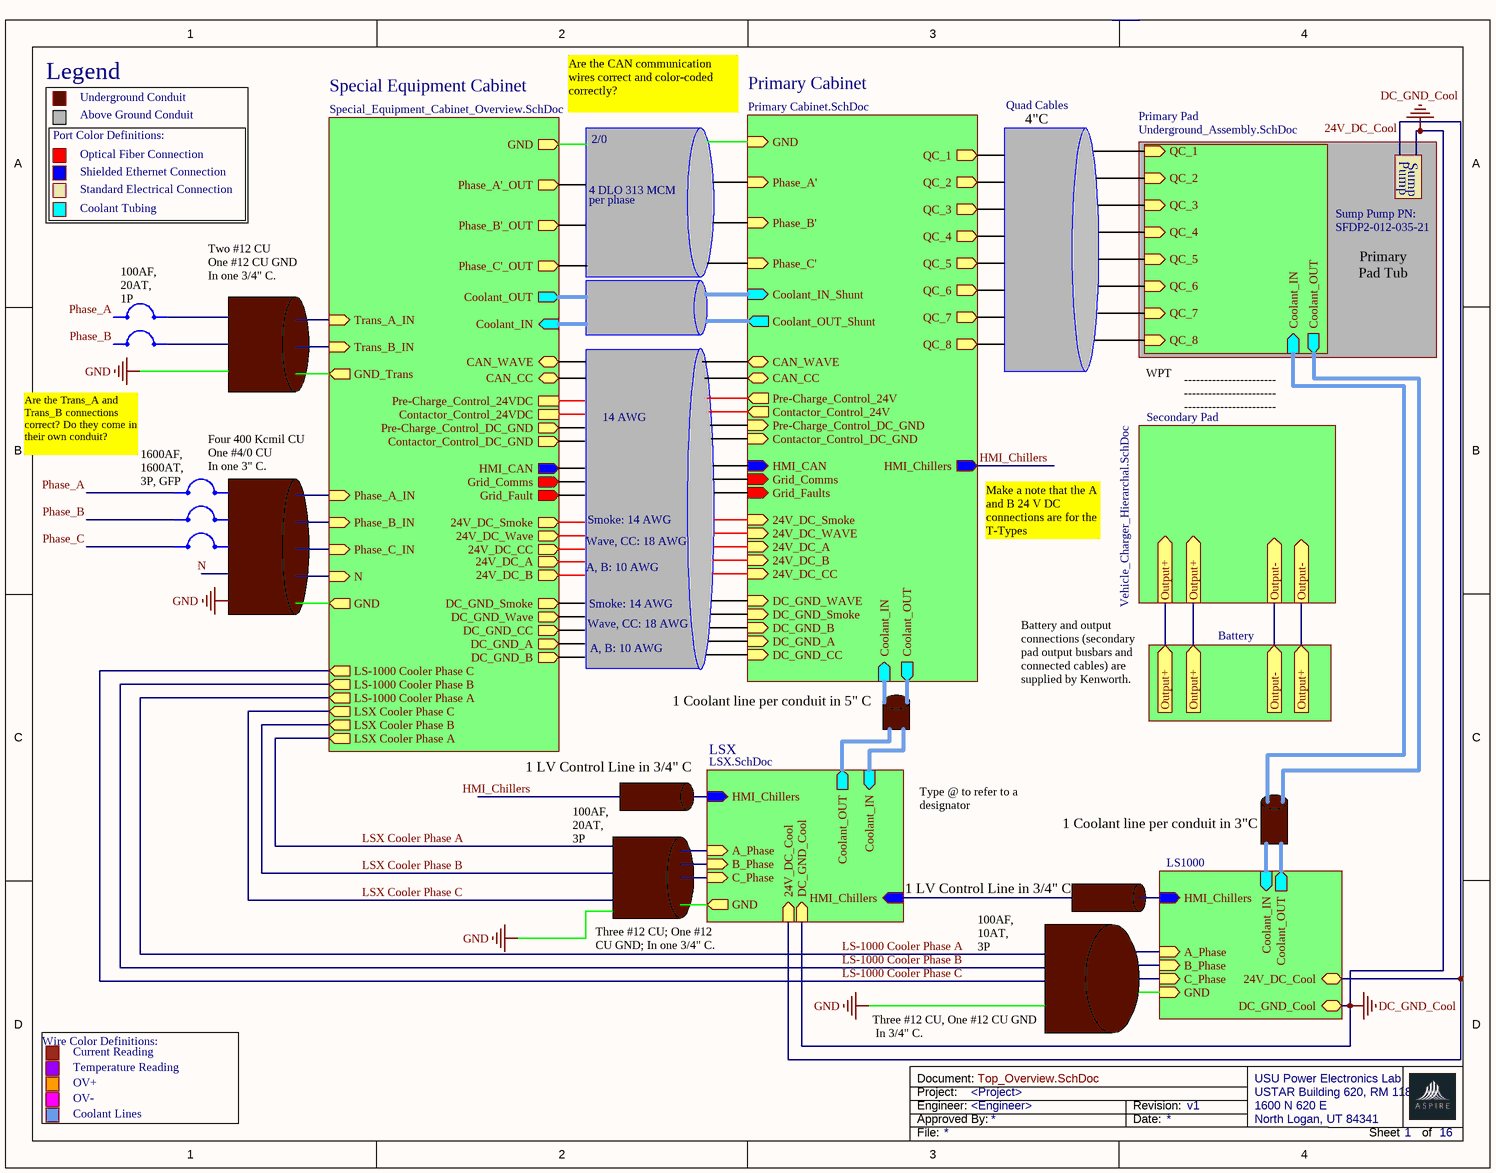
[diagram p8: Top_Overview.SchDoc]

### Parts
B1  Breaker  (value not drawn)
B2  Breaker  (value not drawn)
B3  Breaker  (value not drawn)
B6  Breaker  (value not drawn)
B7  Breaker  (value not drawn)

### Sub-sheets
Designator = File Name (file not in this document): no entries
LS1000 = File Name (file not in this document): A_Phase (in), B_Phase (in), C_Phase (in), GND (in), HMI_Chillers (in), 24V_DC_Cool (bidir), DC_GND_Cool (bidir), Coolant_OUT (out), Coolant_IN (in)
LSX = LSX.SchDoc (file not in this document): A_Phase (in), B_Phase (in), C_Phase (in), GND (out), HMI_Chillers (in), 24V_DC_Cool (in), Coolant_OUT (out), DC_GND_Cool (in), Coolant_IN (in), HMI_Chillers (in)
Primary Cabinet = Primary Cabinet.SchDoc (file not in this document): Phase_A' (in), Phase_B' (in), Phase_C' (in), HMI_CAN (in), Grid_Comms (in), Grid_Faults (in), Coolant_IN (in), Coolant_OUT (out), Coolant_IN_Shunt (in), Coolant_OUT_Shunt (out), QC_2 (out), QC_1 (out), QC_3 (out), QC_6 (out), QC_7 (out), QC_8 (out), QC_5 (out), QC_4 (out), GND (in), Pre-Charge_Control_24V (out), Contactor_Control_24V (out), Contactor_Control_DC_GND (in), Pre-Charge_Control_DC_GND (in), 24V_DC_WAVE (in), DC_GND_WAVE (in), 24V_DC_A (in), 24V_DC_B (in), DC_GND_A (in), DC_GND_B (in), 24V_DC_CC (in), DC_GND_CC (in), HMI_Chillers (out), 24V_DC_Smoke (in), DC_GND_Smoke (in), CAN_WAVE (bidir), CAN_CC (bidir)
Primary Pad = Underground_Assembly.SchDoc: Coolant_OUT (out), Coolant_IN (in), QC_1 (in), QC_2 (in), QC_3 (in), QC_4 (in), QC_5 (in), QC_6 (in), QC_7 (in), QC_8 (in)
Secondary Pad = Vehicle_Charger_Hierarchal.SchDoc: no entries
Special Equipment Cabinet = Special_Equipment_Cabinet_Overview.SchDoc: HMI_CAN (out), GND (out), N (in), Grid_Fault (out), Grid_Comms (out), GND_Trans (out), Coolant_IN (in), Coolant_OUT (out), Phase_A_IN (in), Trans_A_IN (in), Trans_B_IN (in), Phase_B_IN (in), Phase_C_IN (in), Phase_A'_OUT (out), Phase_B'_OUT (out), Phase_C'_OUT (out), GND (out), Contactor_Control_24VDC, Pre-Charge_Control_24VDC, Contactor_Control_DC_GND (out), Pre-Charge_Control_DC_GND (out), 24V_DC_CC (out), 24V_DC_Wave (out), 24V_DC_B (out), 24V_DC_A (out), DC_GND_B (out), DC_GND_A (out), DC_GND_Wave (out), DC_GND_CC (out), 24V_DC_Smoke (out), DC_GND_Smoke (out), LSX Cooler Phase A (out), LSX Cooler Phase B (out), LSX Cooler Phase C (out), LS-1000 Cooler Phase A (out), LS-1000 Cooler Phase B (out), LS-1000 Cooler Phase C (out), CAN_WAVE (bidir), CAN_CC (bidir)

### Ports
Output+ (in), Output+ (out), Output- (in), Output- (out)

### Nets
DC_GND_Cool: sheet LS1000/DC_GND_Cool, sheet LSX/DC_GND_Cool
CAN_CC: sheet Special Equipment Cabinet/CAN_WAVE, sheet Special Equipment Cabinet/CAN_CC
GND: sheet Special Equipment Cabinet/GND, sheet Special Equipment Cabinet/GND
HMI_Chillers: sheet Primary Cabinet/HMI_Chillers
Output+: port Output+, port Output-
Phase_A: B1.0 B6.0
Phase_B: B2.0 B7.0
Phase_C: B3.0
(unnamed): sheet LS1000/24V_DC_Cool, sheet LSX/24V_DC_Cool

Not connected (* = marked no-connect by the designer): B1 1; B2 1; B3 1; B6 1; B7 1

### Notes on the sheet
- Legend
- Underground Conduit
- Are the CAN communication wires correct and color-coded correctly?
- Quad Cables
- Port Color Definitions:
- Optical Fiber Connection
- Shielded Ethernet Connection
- Above Ground Conduit
- 2/0
- 4"C
- Pump
- Sump
- Standard Electrical Connection
- Coolant Tubing
- 4 DLO 313 MCM
- per phase
- Sump Pump PN: SFDP2-012-035-21
- (near B6) 100AF, 20AT, 1P
- Two #12 CU
  One #12 CU GND
  In one 3/4" C.
- Pad Tub
- Primary
- WPT
- Are the Trans_A and Trans_B connections correct? Do they come in their own conduit?
- 14 AWG
- -----------------------
  -----------------------
  -----------------------
- (near B1) 1600AF, 1600AT, 3P, GFP
- (near B1) Four 400 Kcmil CU
  One #4/0 CU
  In one 3" C.
- Wave, CC: 18 AWG
- A, B: 10 AWG
- Smoke: 14 AWG
- Make a note that the A and B 24 V DC connections are for the T-Types
- Battery
- 1 Coolant line per conduit in 5" C
- Battery and output connections (secondary pad output busbars and connected cables) are supplied by Kenworth.
- 1 LV Control Line in 3/4" C
- 100AF, 20AT, 3P
- Type @ to refer to a designator
- 1 Coolant line per conduit in 3"C
- Three #12 CU; One #12 CU GND; In one 3/4" C.
- 100AF, 10AT, 3P
- Current Reading
- Three #12 CU, One #12 CU GND
  In 3/4" C.
- Wire Color Definitions:
- Coolant Lines
- OV-
- OV+
- Temperature Reading
- Labels drawn without touching a wire or pin: 24V_DC_Cool, GND
- Project:
- Engineer:
- Document:
- Approved By:
- Date:
- Revision:
- File:
- Sheet
- of